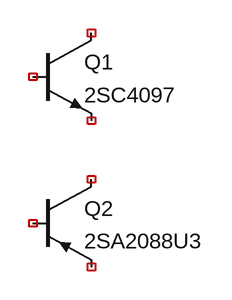
[diagram p0: schematic Draft1.asc]
Draft1.asc, the LTspice schematic file:
Version 4
SHEET 1 880 680
SYMBOL npn 144 112 R0
SYMATTR InstName Q1
SYMATTR Value 2SC4097
SYMBOL pnp 144 272 R0
SYMATTR InstName Q2
SYMATTR Value 2SA2088U3

The netlist it stands for:
* Draft1.asc
Q1 NC_01 NC_02 NC_03 0 2SC4097
Q2 NC_04 NC_05 NC_06 0 2SA2088U3
.model NPN NPN
.model PNP PNP
.lib standard.bjt
.backanno
.end